# EAGLE design v3pow (EAGLE 8.0.1)
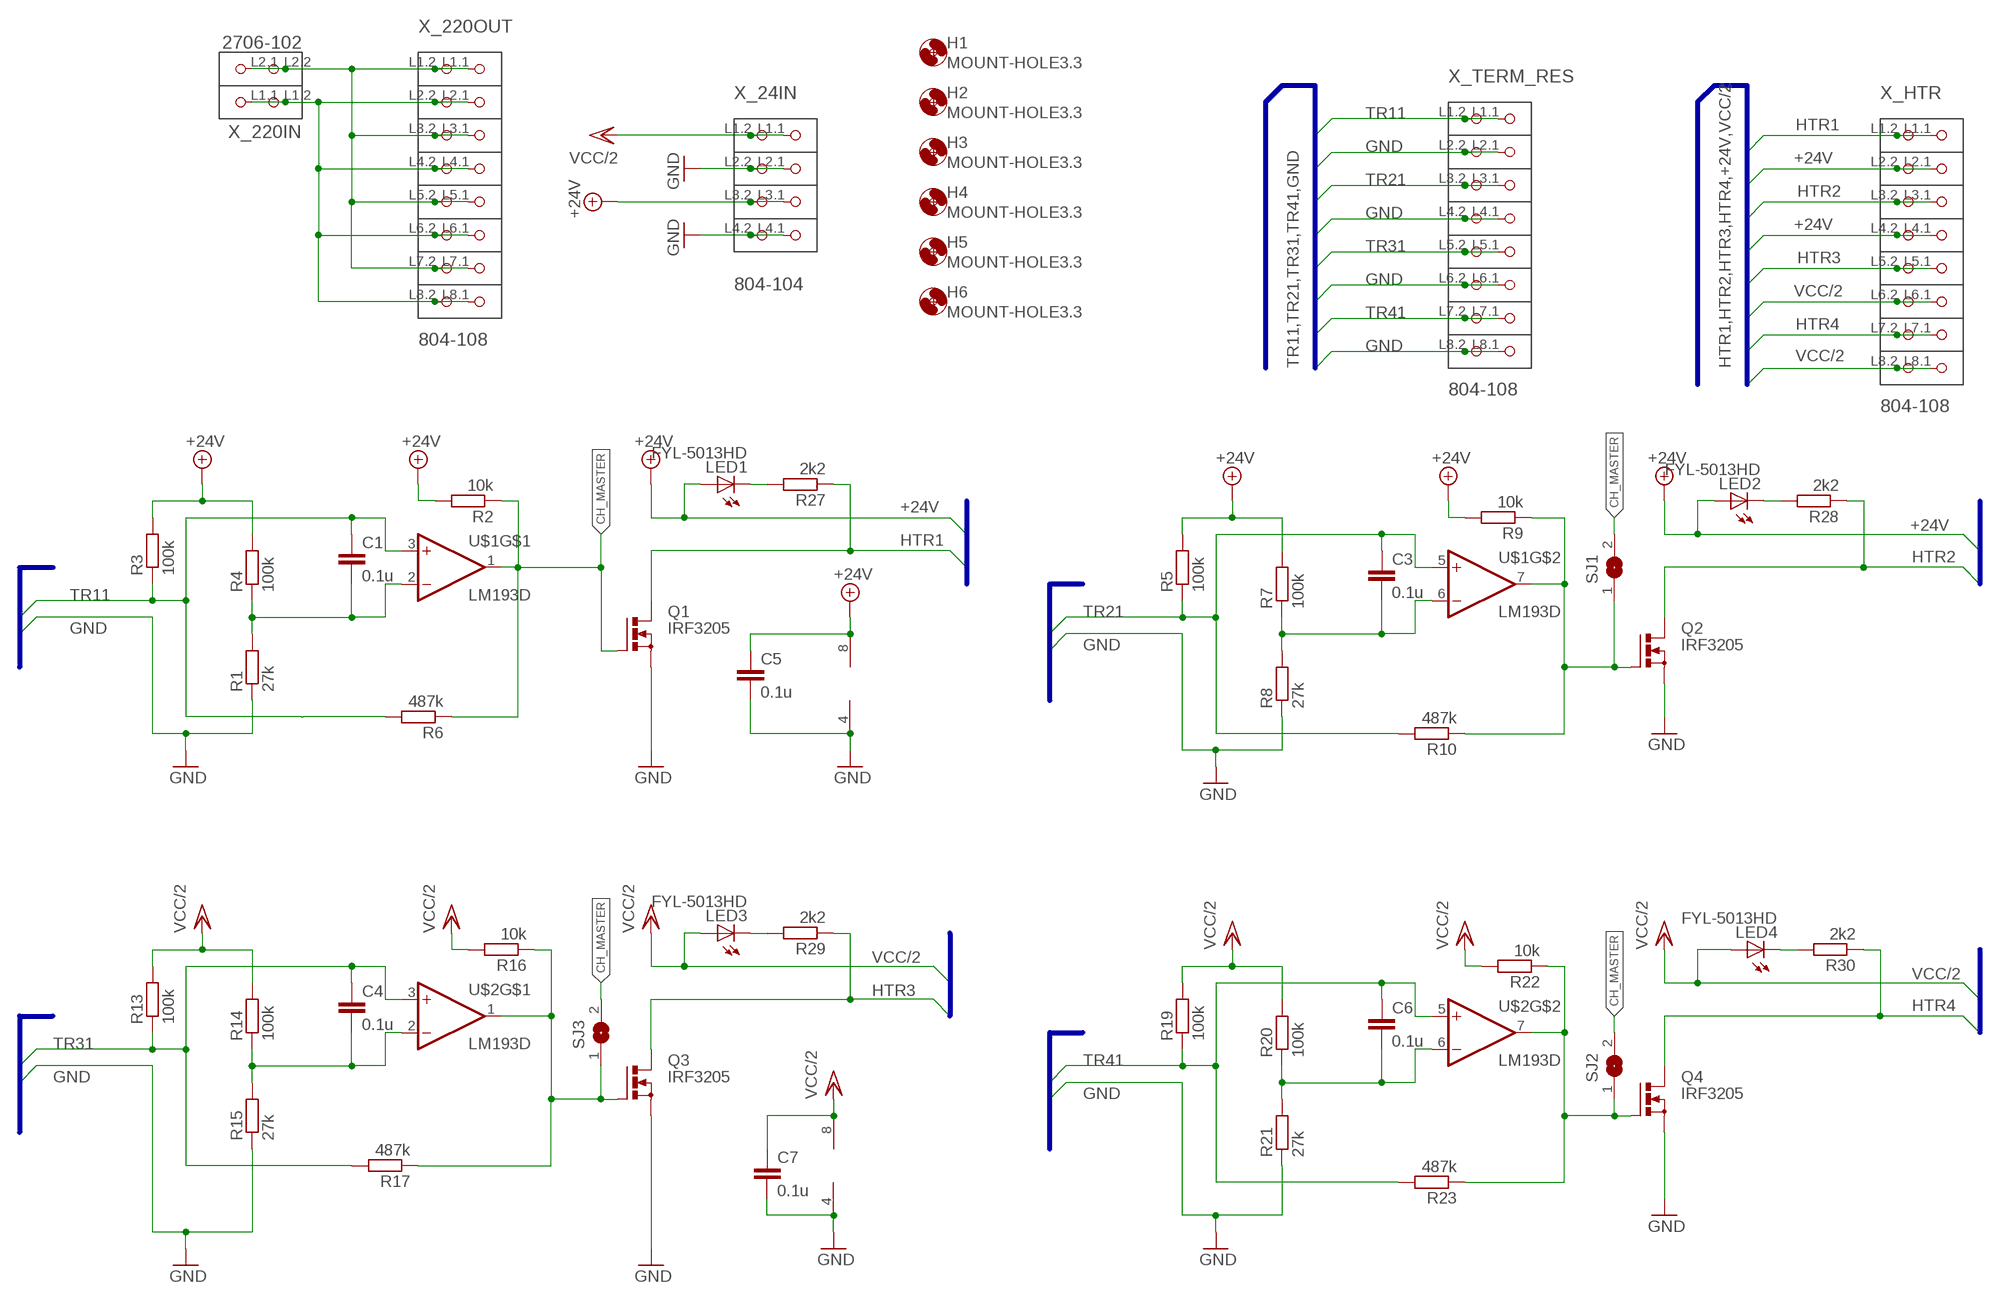
[diagram p0: schematic, sheet 1]

## Parts
C1  0.1u  C-EUC0805  [C0805]
C3  0.1u  C-EUC0805  [C0805]
C4  0.1u  C-EUC0805  [C0805]
C5  0.1u  C-EUC0805  [C0805]
C6  0.1u  C-EUC0805  [C0805]
C7  0.1u  C-EUC0805  [C0805]
H1  MOUNT-HOLE3.3  [3,3]
H2  MOUNT-HOLE3.3  [3,3]
H3  MOUNT-HOLE3.3  [3,3]
H4  MOUNT-HOLE3.3  [3,3]
H5  MOUNT-HOLE3.3  [3,3]
H6  MOUNT-HOLE3.3  [3,3]
LED1  FYL-5013HD  LED5MM  [LED5MM]
LED2  FYL-5013HD  LED5MM  [LED5MM]
LED3  FYL-5013HD  LED5MM  [LED5MM]
LED4  FYL-5013HD  LED5MM  [LED5MM]
Q1  IRF3205  PMOSFET_NTO220BV  [TO220BV]
Q2  IRF3205  PMOSFET_NTO220BV  [TO220BV]
Q3  IRF3205  PMOSFET_NTO220BV  [TO220BV]
Q4  IRF3205  PMOSFET_NTO220BV  [TO220BV]
R1  27k  R-EU_M0805  [M0805]
R2  10k  R-EU_M0805  [M0805]
R3  100k  R-EU_M0805  [M0805]
R4  100k  R-EU_M0805  [M0805]
R5  100k  R-EU_M0805  [M0805]
R6  487k  R-EU_M0805  [M0805]
R7  100k  R-EU_M0805  [M0805]
R8  27k  R-EU_M0805  [M0805]
R9  10k  R-EU_M0805  [M0805]
R10  487k  R-EU_M0805  [M0805]
R13  100k  R-EU_M0805  [M0805]
R14  100k  R-EU_M0805  [M0805]
R15  27k  R-EU_M0805  [M0805]
R16  10k  R-EU_M0805  [M0805]
R17  487k  R-EU_M0805  [M0805]
R19  100k  R-EU_M0805  [M0805]
R20  100k  R-EU_M0805  [M0805]
R21  27k  R-EU_M0805  [M0805]
R22  10k  R-EU_M0805  [M0805]
R23  487k  R-EU_M0805  [M0805]
R27  2k2  R-EU_M0805  [M0805]
R28  2k2  R-EU_M0805  [M0805]
R29  2k2  R-EU_M0805  [M0805]
R30  2k2  R-EU_M0805  [M0805]
SJ1  SJ  [SJ]
SJ2  SJ  [SJ]
SJ3  SJ  [SJ]
U$1  LM193D  [SO08]
U$2  LM193D  [SO08]
X_24IN  804-104  [P-804-104]
X_220IN  2706-102  [P-2706-102]
X_220OUT  804-108  [P-804-108]
X_HTR  804-108  [P-804-108]
X_TERM_RES  804-108  [P-804-108]

## Nets
+24V [24pow]: C5.1 LED1.A LED2.A R2.2 R3.2 R4.2 R5.2 R7.2 R9.2 U$1.8(V+) X_24IN.L3.1(P3.1) X_24IN.L3.2(P3.2) X_HTR.L2.1(P2.1) X_HTR.L2.2(P2.2) X_HTR.L4.1(P4.1) X_HTR.L4.2(P4.2)
CH_MASTER: Q1.G R2.1 R6.1 SJ1.2 SJ2.2 SJ3.2 U$1.1(OUT)
GND [24pow]: C5.2 C7.2 Q1.S Q2.S Q3.S Q4.S R1.1 R8.1 R15.1 R21.1 U$1.4(V-) U$2.4(V-) X_24IN.L2.1(P2.1) X_24IN.L2.2(P2.2) X_24IN.L4.1(P4.1) X_24IN.L4.2(P4.2) X_TERM_RES.L2.1(P2.1) X_TERM_RES.L2.2(P2.2) X_TERM_RES.L4.1(P4.1) X_TERM_RES.L4.2(P4.2) X_TERM_RES.L6.1(P6.1) X_TERM_RES.L6.2(P6.2) X_TERM_RES.L8.1(P8.1) X_TERM_RES.L8.2(P8.2)
HTR1: Q1.D R27.1 X_HTR.L1.1(P1.1) X_HTR.L1.2(P1.2)
HTR2: Q2.D R28.1 X_HTR.L3.1(P3.1) X_HTR.L3.2(P3.2)
HTR3: Q3.D R29.1 X_HTR.L5.1(P5.1) X_HTR.L5.2(P5.2)
HTR4: Q4.D R30.1 X_HTR.L7.1(P7.1) X_HTR.L7.2(P7.2)
N44 [f220]: X_220IN.L2.1(P2.1) X_220IN.L2.2(P2.2) X_220OUT.L1.1(P1.1) X_220OUT.L1.2(P1.2) X_220OUT.L3.1(P3.1) X_220OUT.L3.2(P3.2) X_220OUT.L5.1(P5.1) X_220OUT.L5.2(P5.2) X_220OUT.L7.1(P7.1) X_220OUT.L7.2(P7.2)
N$1: Q3.G R16.1 R17.1 SJ3.1 U$2.1(OUT)
N$2: Q2.G R9.1 R10.1 SJ1.1 U$1.7(OUT)
N$3: Q4.G R22.1 R23.1 SJ2.1 U$2.7(OUT)
N$10: C3.2 R7.1 R8.2 U$1.6(-IN)
N$13: C1.2 R1.2 R4.1 U$1.2(-IN)
N$15: C4.2 R14.1 R15.2 U$2.2(-IN)
N$20: C6.2 R20.1 R21.2 U$2.6(-IN)
N$28: LED1.K(C) R27.2
N$31: LED2.K(C) R28.2
N$34: LED3.K(C) R29.2
N$36: LED4.K(C) R30.2
NN55 [f220]: X_220IN.L1.1(P1.1) X_220IN.L1.2(P1.2) X_220OUT.L2.1(P2.1) X_220OUT.L2.2(P2.2) X_220OUT.L4.1(P4.1) X_220OUT.L4.2(P4.2) X_220OUT.L6.1(P6.1) X_220OUT.L6.2(P6.2) X_220OUT.L8.1(P8.1) X_220OUT.L8.2(P8.2)
TR11: C1.1 R3.1 R6.2 U$1.3(+IN) X_TERM_RES.L1.1(P1.1) X_TERM_RES.L1.2(P1.2)
TR21: C3.1 R5.1 R10.2 U$1.5(+IN) X_TERM_RES.L3.1(P3.1) X_TERM_RES.L3.2(P3.2)
TR31: C4.1 R13.1 R17.2 U$2.3(+IN) X_TERM_RES.L5.1(P5.1) X_TERM_RES.L5.2(P5.2)
TR41: C6.1 R19.1 R23.2 U$2.5(+IN) X_TERM_RES.L7.1(P7.1) X_TERM_RES.L7.2(P7.2)
VCC/2: C7.1 LED3.A LED4.A R13.2 R14.2 R16.2 R19.2 R20.2 R22.2 U$2.8(V+) X_24IN.L1.1(P1.1) X_24IN.L1.2(P1.2) X_HTR.L6.1(P6.1) X_HTR.L6.2(P6.2) X_HTR.L8.1(P8.1) X_HTR.L8.2(P8.2)

## Buses
TR11,TR12,TR21,TR22,TR31,TR32,TR41,TR42,GND
HTR1,HTR2,HTR3,HTR4,+24V,VCC/2
TR11,TR21,TR31,TR41,GND

## Library data of the parts
C1 C3-C7 = rcl:C-EU: CAPACITOR, European symbol
H1-H6 = holes:MOUNT-HOLE: MOUNTING HOLE with drill center marker
LED1-LED4 = adafruit:LED: LED OSRAM: - CHIPLED LG R971, LG N971, LY N971, LG Q971, LY Q971, LO R971, LY R971 LH N974, LH R974 LS Q976, LO Q976, LY Q976 LO Q996 - Hyper CHIPLED LW Q18S LB Q993, LB Q99A, LB R99A - SideLED LS A670, LO A670, LY A670, LG A670, LP A670 LB A673, LV A673, LT A673, LW A673 LH A674 LY A675 LS A676, LA A676, LO A676, LY A676, LW A676 LS A679, LY A679, LG A679 - Hyper Micro SIDELED® LS Y876, LA Y876, LO Y876, LY Y876 LT Y87S - SmartLED LW L88C, LW L88S LB L89C, LB L89S, LG L890 LS L89K, LO L89K, LY L89K LS L896, LA L896, LO L896, LY L896 - TOPLED LS T670, LO T670, LY T670, LG T670, LP T670 LSG T670, LSP T670, LSY T670, LOP T670, LYG T670 LG T671, LOG T671, LSG T671 LB T673, LV T673, LT T673, LW T673 LH T674 LS T676, LA T676, LO T676, LY T676, LB T676, LH T676, LSB T676, LW T676 LB T67C, LV T67C, LT T67C, LS T67K, LO T67K, LY T67K, LW E67C LS E67B, LA E67B, LO E67B, LY E67B, LB E67C, LV E67C, LT E67C LW T67C LS T679, LY T679, LG T679 LS T770, LO T770, LY T770, LG T770, LP T770 LB T773, LV T773, LT T773, LW T773 LH T774 LS E675, LA E675, LY E675, LS T675 LS T776, LA T776, LO T776, LY T776, LB T776 LHGB T686 LT T68C, LB T68C - Hyper Mini TOPLED® LB M676 - Mini TOPLED Santana® LG M470 LS M47K, LO M47K, LY M47K Source: http://www.osram.convergy.de/
Q1-Q4 = transistor-power:PMOSFET_N: Power MOSFET N-Channel
R1-R10 R13-R17 R19-R23 R27-R30 = rcl:R-EU_: RESISTOR, European symbol
SJ1-SJ3 = jumper:SJ: SMD solder JUMPER
U$1 U$2 = linear:LM193: lm193 LM193
X_24IN = con-wago_804:804-104: Serie 804, 1-Leiter-Klemmenleiste für Leiterplatten 2 Lötstifte/Pol versetzt / Series 804, 1-conductor PCB terminal strip 2 solder pins/pole, staggered Polzahl / Pole No.: 4 Rastermaß / Pitch: 5 - 5 mm Bemessungsspannung / Rated Voltage: 320 V Nennstrom / Nominal Current: 24 A Leiterquerschnitt / Conductor Size: 0.25 - 2.5 mm2 Anschlusstechnik / Connection Technology: CAGE CLAMP® S Lötstiftlänge: / Solder Pin Length: 3.6 mm Leitereinführung (zur Platine) / Conductor entry angle (to PCB): 0 ° Farbe / Color: grau / gray Stand: 01.01.2014. Die jeweils aktuellen Daten zu diesem Artikel finden Sie in unserem Produktkatalog, den Sie unter www.wago.com einsehen können. As of: 01/01/2014. Please find the newest data for this article in our product catalogue, which can be viewed under www.wago.com.
X_220IN = con-wago_2706:2706-102: Serie 2706, Klemmenleisten mit Betätigungshebeln 2 Lötstifte/Pol / Series 2706, Terminal strips with operating levers 2 solder pins/pole Polzahl / Pole No.: 2 Rastermaß / Pitch: 7.5 mm Bemessungsspannung / Rated Voltage: 630 V Nennstrom / Nominal Current: 41 A Leiterquerschnitt / Conductor Size: 0.5 - 6 mm2 Anschlusstechnik / Connection Technology: CAGE CLAMP® Lötstiftlänge: / Solder Pin Length: 4.5 mm Leitereinführung (zur Platine) / Conductor entry angle (to PCB): 30 ° Farbe / Color: grau / gray Stand: 01.01.2014. Die jeweils aktuellen Daten zu diesem Artikel finden Sie in unserem Produktkatalog, den Sie unter www.wago.com einsehen können. As of: 01/01/2014. Please find the newest data for this article in our product catalogue, which can be viewed under www.wago.com.
X_220OUT X_HTR X_TERM_RES = con-wago_804:804-108: Serie 804, 1-Leiter-Klemmenleiste für Leiterplatten 2 Lötstifte/Pol versetzt / Series 804, 1-conductor PCB terminal strip 2 solder pins/pole, staggered Polzahl / Pole No.: 8 Rastermaß / Pitch: 5 - 5 mm Bemessungsspannung / Rated Voltage: 320 V Nennstrom / Nominal Current: 24 A Leiterquerschnitt / Conductor Size: 0.25 - 2.5 mm2 Anschlusstechnik / Connection Technology: CAGE CLAMP® S Lötstiftlänge: / Solder Pin Length: 3.6 mm Leitereinführung (zur Platine) / Conductor entry angle (to PCB): 0 ° Farbe / Color: grau / gray Stand: 01.01.2014. Die jeweils aktuellen Daten zu diesem Artikel finden Sie in unserem Produktkatalog, den Sie unter www.wago.com einsehen können. As of: 01/01/2014. Please find the newest data for this article in our product catalogue, which can be viewed under www.wago.com.

## Net classes
0 default: width 0.508 mm
1 f220: width 1.524 mm, clearance 1.27 mm
2 24pow: width 1.016 mm

## Board
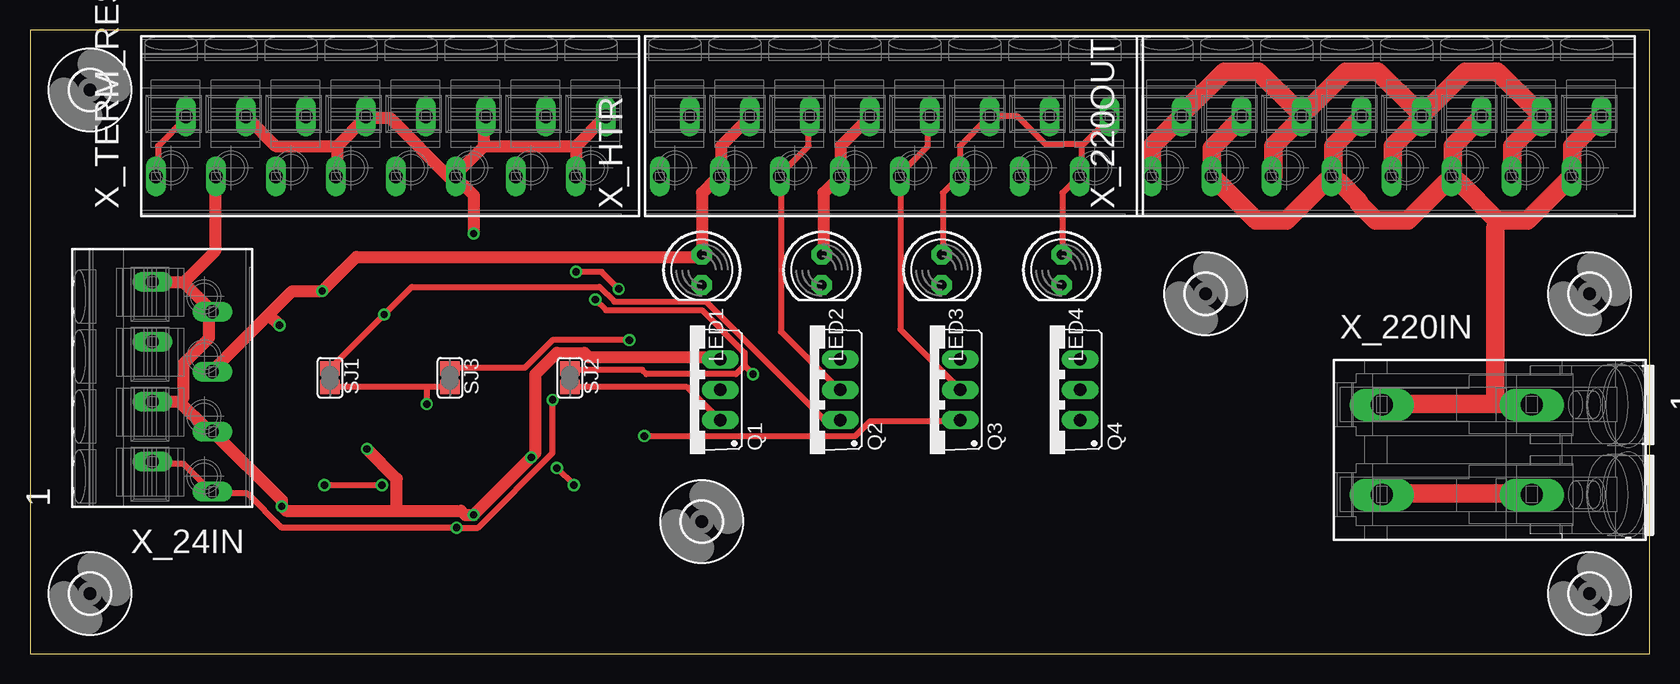
[diagram p1: board, top side]
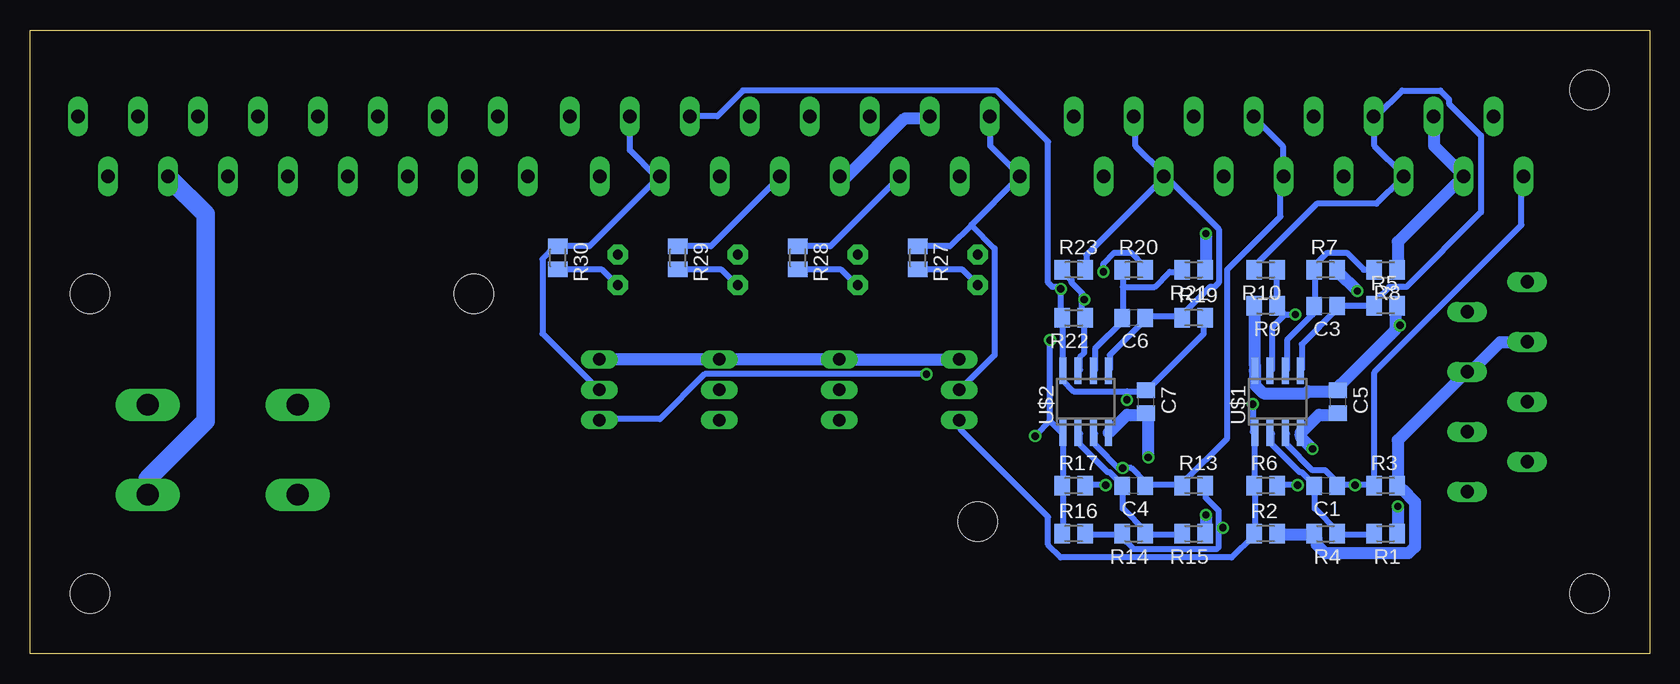
[diagram p2: board, bottom side, seen from below]

Size 135 x 52 mm. Coordinates in mm from the lower left corner, seen from the top.
Outline: 0,0 135,0 135,52 0,52 0,0
Copper layers (1*16): Top 0.035mm / dielectric 1.5mm / Bottom 0.035mm
Design rules "default": minimum track width 10mil, minimum drill 24mil, track to track 8mil, track to pad 8mil, pad to pad 8mil, via to via 8mil, smd to smd 8mil, copper to edge 40mil, drill to drill 8mil, minimum pad ring 10mil, minimum via ring 8mil, stop-mask expansion 4mil, vias tented up to drill 0mil, thermal gap 10mil

### Footprints (pad centres in the part's own frame; a part is rotated, then mirrored left to right if it is on the bottom)
C0805 = smd 1.3 x 1.5: 1 -0.95,0; 2 0.95,0
3,3 = hole 3.3: 0,0
LED5MM = drill 0.813 pad 1.676 octagon: A -1.27,0; K 1.27,0
TO220BV = drill 1.016 long: D 0,-2.54; G -2.54,-2.54; S 2.54,-2.54
M0805 = smd 1.3 x 1.6: 1 -0.95,0; 2 0.95,0
SJ = smd 1.168 x 1.6: 1 -0.762,0; 2 0.762,0
SO08 = smd 0.6 x 2.2: 1 -1.905,-2.6; 2 -0.635,-2.6; 3 0.635,-2.6; 4 1.905,-2.6; 5 1.905,2.6; 6 0.635,2.6; 7 -0.635,2.6; 8 -1.905,2.6
P-804-104 = drill 1.1 long: L1.1 0.8,7; L1.2 -4.2,9.5; L2.1 0.8,2; L2.2 -4.2,4.5; L3.1 0.8,-3; L3.2 -4.2,-0.5; L4.1 0.8,-8; L4.2 -4.2,-5.5
P-2706-102 = drill 1.8 long: L1.1 3.185,3.75; L1.2 -9.315,3.75; L2.1 3.185,-3.75; L2.2 -9.315,-3.75
P-804-108 = drill 1.1 long: L1.1 0.8,17; L1.2 -4.2,19.5; L2.1 0.8,12; L2.2 -4.2,14.5; L3.1 0.8,7; L3.2 -4.2,9.5; L4.1 0.8,2; L4.2 -4.2,4.5; L5.1 0.8,-3; L5.2 -4.2,-0.5; L6.1 0.8,-8; L6.2 -4.2,-5.5; L7.1 0.8,-13; L7.2 -4.2,-10.5; L8.1 0.8,-18; L8.2 -4.2,-15.5

### Placement (x,y rotation side)
C1  27,14 180 bottom
C3  27,29 180 bottom
C4  43,14 180 bottom
C5  26,21 270 bottom
C6  43,28 180 bottom
C7  42,21 270 bottom
H1  5,47 0 top
H2  5,5 0 top
H3  130,5 0 top
H4  56,11 0 top
H5  130,30 0 top
H6  98,30 0 top
LED1  56,32 270 top
LED2  66,32 270 top
LED3  76,32 270 top
LED4  86,32 270 top
Q1  55,22 90 top
Q2  65,22 90 top
Q3  75,22 90 top
Q4  85,22 90 top
R1  22,10 180 bottom
R2  32,10 0 bottom
R3  22,14 0 bottom
R4  27,10 180 bottom
R5  22,29 0 bottom
R6  32,14 0 bottom
R7  27,32 0 bottom
R8  22,32 180 bottom
R9  32,29 180 bottom
R10  32,32 180 bottom
R13  38,14 0 bottom
R14  43,10 180 bottom
R15  38,10 180 bottom
R16  48,10 0 bottom
R17  48,14 0 bottom
R19  38,28 0 bottom
R20  43,32 0 bottom
R21  38,32 180 bottom
R22  48,28 180 bottom
R23  48,32 0 bottom
R27  61,33 270 bottom
R28  71,33 270 bottom
R29  81,33 270 bottom
R30  91,33 270 bottom
SJ1  25,23 270 top
SJ2  45,23 270 top
SJ3  35,23 270 top
U$1  31,21 0 bottom
U$2  47,21 0 bottom
X_24IN  11,23 180 top
X_220IN  122,17 0 top
X_220OUT  113,44 90 top
X_HTR  72,44 90 top
X_TERM_RES  30,44 90 top

### Tracks (layer width: path | path; a pad name or v marks a point on that pad's centre or on a via)
+24V  (via drill 0.61)
  Top 1.016: X_HTR.L2.1 59.92,44.63 57.61,42.32 57.61,39.83 X_HTR.L2.2 57.07,39.47 56.01,38.41 56.01,33.43 LED1.A 55.65,33.07 27.2,33.07 v24.36,30.23 21.87,30.23 19.91,28.27 | X_HTR.L4.1 69.88,44.63 67.56,42.32 67.56,39.83 X_HTR.L4.2 67.21,39.47 66.14,38.41 66.14,33.43 LED2.A | 19.91,28.27 15.29,23.65 X_24IN.L3.2 | 19.91,28.27 v20.8,27.38
  Bottom 1.016: X_HTR.L2.1 60.1,44.63 62.05,44.63 66.85,39.83 67.39,39.83 X_HTR.L4.2 | 21.16,27.38 21.16,27.03 25.78,22.4 C5.1 26.14,21.87 28.45,21.87 28.63,21.69 32.18,21.69 32.89,22.4 32.89,23.47 U$1.8 32.89,24 32.89,28.98 R9.2 | 21.16,27.38 21.16,28.98 R5.2 | R2.2 30.94,9.96 28.09,9.96 R4.2 27.74,9.6 27.74,9.07 27.03,8.36 20.09,8.36 19.56,8.89 19.56,12.62 20.62,13.69 R3.2 20.98,14.05 20.98,17.78 15.29,23.47 X_24IN.L3.2 14.76,23.65 12.45,25.96 10.31,25.96 X_24IN.L3.1 | v24.36,30.23 25.96,31.83 R7.2 | v20.8,27.38 21.16,27.38
CH_MASTER  (via drill 0.61)
  Top 0.508: SJ2.2 45.16,22.23 54.76,22.23 57.43,19.56 Q1.G | 33.07,22.23 34.85,22.23 SJ3.2 | 33.07,22.23 25.07,22.23 SJ1.2 | 33.07,22.23 v33.07,20.8
  Bottom 0.508: v33.07,20.8 33.07,18.49 U$1.1 32.89,18.31 32.89,14.22 R6.1 32.89,13.87 32.89,10.13 R2.1 33.07,9.78 34.85,8 49.07,8 50.14,9.07 50.14,11.38 57.43,18.67 57.43,19.38 Q1.G
GND  (via drill 0.61)
  Top 1.016: 25.6,42.32 25.6,39.83 X_TERM_RES.L4.2 | 25.6,42.32 27.91,44.63 X_TERM_RES.L4.1 28.45,44.63 30.05,44.63 35.03,39.65 X_TERM_RES.L6.2 | 25.6,42.32 20.45,42.32 18.14,44.63 X_TERM_RES.L2.1 | 45.52,42.32 45.52,39.83 X_TERM_RES.L8.2 | 45.52,42.32 47.83,44.63 X_TERM_RES.L8.1 | v36.98,35.03 36.98,38.23 35.56,39.65 X_TERM_RES.L6.2 | 37.87,42.32 37.87,44.63 X_TERM_RES.L6.1 | 37.87,42.32 35.74,40.18 X_TERM_RES.L6.2 | 37.87,42.32 45.52,42.32 | 12.8,30.94 10.31,30.94 X_24IN.L4.1 | 12.8,30.94 15.11,28.63 X_24IN.L4.2 14.94,28.09 14.94,26.31 12.8,24.18 12.8,21.34 12.45,20.98 | 30.58,11.91 21.34,11.91 v20.98,12.27 20.98,12.8 15.29,18.49 X_24IN.L2.2 14.76,18.67 12.45,20.98 | 30.58,11.91 35.92,11.91 36.27,11.56 v36.98,11.56 v41.78,16.36 42.14,16.71 42.14,23.29 43.92,25.07 46.23,25.07 46.58,24.71 57.43,24.71 Q1.S | 12.45,20.98 10.31,20.98 X_24IN.L2.1 | v28.09,17.07 30.58,14.58 30.58,11.91 | 12.8,30.94 15.47,33.6 15.47,39.65 X_TERM_RES.L2.2
  Bottom 1.016: R8.1 20.98,32 20.98,34.31 15.65,39.65 X_TERM_RES.L2.2 15.82,40.18 17.96,42.32 17.96,44.63 X_TERM_RES.L2.1 | v36.98,35.03 36.98,32 R21.1 | Q1.S 57.61,24.54 67.39,24.54 Q2.S 67.92,24.54 77.52,24.54 Q3.S 78.05,24.54 87.48,24.54 Q4.S | U$2.4 44.98,18.49 43.56,19.91 42.14,19.91 C7.2 41.78,19.56 v41.78,16.36 | C5.2 26.14,19.91 27.56,19.91 28.98,18.49 U$1.4 28.98,17.96 v28.09,17.07 | v20.98,12.27 20.98,10.13 R1.1 | v36.98,11.56 36.98,10.13 R15.1
HTR1
  Bottom 0.508: 56.54,35.74 52.63,39.65 X_HTR.L1.2 52.63,40.01 54.94,42.32 54.94,44.63 X_HTR.L1.1 | 56.54,35.74 58.32,33.96 60.98,33.96 R27.1 | 56.54,35.74 54.59,33.78 54.59,24.89 57.43,22.05 Q1.D
HTR2
  Top 0.508: Q2.D 67.39,22.05 62.59,26.85 62.59,39.65 X_HTR.L3.2 62.59,40.01 64.9,42.32 64.9,44.63 X_HTR.L3.1
  Bottom 0.508: R28.1 70.94,33.96 68.28,33.96 62.59,39.65 X_HTR.L3.2
HTR3
  Top 0.508: Q3.D 77.52,22.05 72.54,27.03 72.54,39.65 X_HTR.L5.2 72.54,40.01 74.85,42.32 74.85,44.63 X_HTR.L5.1
  Bottom 0.508: R29.1 80.9,33.96 78.23,33.96 72.54,39.65 X_HTR.L5.2
HTR4
  Bottom 0.508: Q4.D 87.66,22.05 92.28,26.67 92.28,32.89 91.21,33.96 R30.1 90.86,33.96 88.37,33.96 82.68,39.65 X_HTR.L7.2 82.86,39.83 84.99,41.96 84.99,44.63 X_HTR.L7.1
N44
  Top 1.524: X_220OUT.L1.2 93.52,39.83 93.52,42.32 95.83,44.63 X_220OUT.L1.1 96.37,45.34 99.57,48.54 102.41,48.54 105.61,45.34 X_220OUT.L3.1 | X_220OUT.L3.2 103.66,39.83 103.66,42.32 105.97,44.63 X_220OUT.L3.1 | X_220IN.L2.2 112.72,13.34 125.17,13.34 X_220IN.L2.1 | X_220OUT.L5.2 113.61,39.83 113.61,42.32 115.93,44.63 X_220OUT.L5.1 | X_220OUT.L7.2 123.57,39.83 123.57,42.32 125.88,44.63 X_220OUT.L7.1 125.53,45.34 122.33,48.54 119.66,48.54 116.46,45.34 X_220OUT.L5.1 | X_220OUT.L3.1 106.5,45.34 109.7,48.54 112.37,48.54 115.57,45.34 X_220OUT.L5.1
  Bottom 1.524: X_220IN.L2.1 125.17,13.34 125.17,14.58 120.37,19.38 120.37,36.63 123.39,39.65 X_220OUT.L7.2
N$1  (via drill 0.61)
  Top 0.508: v49.96,26.14 43.56,26.14 41.25,23.82 35.03,23.82 SJ3.1 | v51.21,18.14 68.81,18.14 70.05,19.38 77.52,19.38 Q3.G
  Bottom 0.508: R16.1 48.9,10.13 48.9,13.87 R17.1 48.9,14.22 48.9,18.31 U$2.1 49.07,18.49 49.96,19.38 | 49.96,19.38 v49.96,26.14 | 49.96,19.38 v51.21,18.14
N$2  (via drill 0.61)
  Top 0.508: SJ1.1 25.07,23.82 v29.52,28.27 31.83,30.58 47.47,30.58 48.72,29.34 56.36,29.34 66.14,19.56 67.39,19.56 Q2.G
  Bottom 0.508: R10.1 31.11,31.83 31.11,29.16 R9.1 30.94,28.8 30.4,28.27 | 30.4,28.27 v29.52,28.27 | 30.4,28.27 31.47,27.2 31.47,23.65 U$1.7
N$3  (via drill 0.61)
  Top 0.508: 59.56,24 58.85,23.29 51.38,23.29 51.03,23.65 45.16,23.65 SJ2.1 | 59.56,24 59.56,25.07 56.01,28.63 48.01,28.63 v47.12,29.52 | 59.56,24 v60.27,23.29
  Bottom 0.508: U$2.7 47.47,23.65 47.47,24.71 47.12,25.07 47.12,27.91 R22.1 47.3,28.09 47.3,29.52 | 47.3,29.52 47.3,30.05 48.18,30.94 48.18,31.11 48.9,31.83 R23.1 | v47.12,29.52 47.3,29.52 | v60.27,23.29 78.77,23.29 82.5,19.56 87.48,19.56 Q4.G
N$10
  Bottom 0.508: R8.2 23.11,32 23.82,32 25.25,33.43 26.85,33.43 28.09,32.18 R7.1 27.91,31.83 27.91,29.16 C3.2 28.09,28.8 28.09,28.27 30.23,26.14 30.23,23.65 U$1.6
N$13
  Bottom 0.508: R1.2 23.11,9.96 25.78,9.96 R4.1 25.96,10.13 27.91,12.09 27.91,13.87 C1.2 28.09,14.22 28.98,15.11 29.16,15.11 31.47,17.42 31.47,18.31 U$1.2
N$15
  Bottom 0.508: R15.2 39.12,9.96 41.78,9.96 R14.1 41.96,10.13 43.92,12.09 43.92,13.87 C4.2 44.09,14.22 44.98,15.11 45.16,15.11 47.47,17.42 47.47,18.31 U$2.2
N$20
  Bottom 0.508: 43.92,30.58 43.92,31.83 R20.1 | 43.92,30.58 43.92,28.09 C6.2 43.92,27.74 46.23,25.43 46.23,23.65 U$2.6 | 43.92,30.58 41.25,30.58 40.01,31.83 39.12,31.83 R21.2
N$28
  Bottom 0.508: R27.2 60.98,32 57.25,32 56.01,30.76 LED1.K
N$31
  Bottom 0.508: R28.2 70.94,32 67.39,32 66.14,30.76 LED2.K
N$34
  Bottom 0.508: R29.2 80.9,32 77.34,32 76.1,30.76 LED3.K
N$36
  Bottom 0.508: R30.2 90.86,32 87.3,32 86.06,30.76 LED4.K
NN55
  Top 1.524: X_220OUT.L2.1 100.99,44.63 98.5,42.14 98.5,39.83 X_220OUT.L2.2 99.03,39.29 102.23,36.09 104.72,36.09 107.92,39.29 X_220OUT.L4.2 | X_220OUT.L4.2 108.64,39.83 108.64,42.32 110.95,44.63 X_220OUT.L4.1 | 122.15,20.8 125.17,20.8 X_220IN.L1.1 | 122.15,20.8 112.72,20.8 X_220IN.L1.2 | X_220OUT.L6.2 118.59,39.83 118.59,42.32 120.9,44.63 X_220OUT.L6.1 | X_220OUT.L8.1 130.86,44.63 128.55,42.32 128.55,39.83 X_220OUT.L8.2 128.02,39.29 124.82,36.09 122.33,36.09 | 122.33,36.09 119.13,39.29 X_220OUT.L6.2 | 122.15,20.8 122.15,35.38 122.33,36.09 | X_220OUT.L4.2 109.17,39.29 110.77,37.69 110.77,37.52 112.19,36.09 114.86,36.09 118.06,39.29 X_220OUT.L6.2
TR11  (via drill 0.61)
  Top 0.508: X_TERM_RES.L1.2 10.67,39.83 10.67,42.32 12.98,44.63 X_TERM_RES.L1.1 | v24.54,14.05 v29.34,14.05
  Bottom 0.508: v29.34,14.05 30.94,14.05 R6.2 | U$1.3 30.23,18.31 30.23,17.42 28.09,15.29 27.03,15.29 25.96,14.22 C1.1 25.96,14.05 v24.54,14.05 23.11,14.05 R3.1 22.94,14.22 22.94,23.47 10.67,35.74 10.67,39.65 X_TERM_RES.L1.2
TR21
  Bottom 0.508: U$1.5 28.98,23.65 28.98,25.78 25.96,28.8 C3.1 25.96,28.98 23.11,28.98 R5.1 22.76,29.16 22.76,29.52 21.69,30.58 20.27,30.58 14.05,36.8 14.05,43.2 16.71,45.87 16.71,46.23 17.42,46.94 20.62,46.94 22.76,44.81 X_TERM_RES.L3.1 22.94,44.63 22.94,42.32 20.62,40.01 X_TERM_RES.L3.2 20.62,39.65 22.76,37.52 27.74,37.52 32.89,32.36 32.89,32 R10.2
TR31  (via drill 0.61)
  Top 0.508: v43.92,15.47 v45.34,14.05
  Bottom 0.508: X_TERM_RES.L5.1 32.89,44.63 30.58,42.32 30.58,39.83 X_TERM_RES.L5.2 30.76,39.65 30.76,36.45 35.2,32 35.2,17.96 38.94,14.22 R13.1 39.12,14.05 41.96,14.05 C4.1 41.96,14.22 43.2,15.47 v43.92,15.47 44.09,15.29 46.23,17.42 46.23,18.31 U$2.3 | v45.34,14.05 46.94,14.05 R17.2
TR41
  Bottom 0.508: U$2.5 44.98,23.65 44.98,24.89 41.96,27.91 C6.1 41.96,28.09 39.12,28.09 R19.1 38.94,28.27 36.63,30.58 36.27,30.58 35.92,30.94 35.92,35.38 40.36,39.83 X_TERM_RES.L7.2 | R23.2 46.94,32 46.94,33.25 40.54,39.65 X_TERM_RES.L7.2 | X_TERM_RES.L7.1 42.85,44.63 42.85,42.32 40.54,40.01 X_TERM_RES.L7.2
VCC/2  (via drill 0.61)
  Top 0.508: LED3.A 76.1,33.43 76.1,38.41 77.34,39.65 X_HTR.L6.2 77.52,39.83 77.52,42.32 79.83,44.63 X_HTR.L6.1 80.19,44.81 82.32,44.81 84.63,42.49 87.48,42.49 87.66,42.32 | 87.66,42.32 87.66,39.83 X_HTR.L8.2 87.3,39.65 86.06,38.41 86.06,33.43 LED4.A | 87.66,42.32 89.97,44.63 X_HTR.L8.1 | v45.52,31.83 47.65,31.83 v49.07,30.4 | X_24IN.L1.1 10.31,15.82 12.8,15.82 15.11,13.51 X_24IN.L1.2 15.29,13.34 18.14,13.34 20.98,10.49 v35.56,10.49 37.34,10.49 43.56,16.71 v43.56,21.16
  Bottom 0.508: 43.56,21.87 48.01,21.87 48.9,22.76 48.9,23.47 U$2.8 48.9,23.82 48.9,27.91 R22.2 49.07,28.09 v49.07,30.4 49.25,30.58 49.78,30.58 50.14,30.94 50.14,42.67 54.41,46.94 75.56,46.94 77.7,44.81 79.83,44.81 X_HTR.L6.1 | 43.56,21.87 42.14,21.87 C7.1 41.78,22.05 37.16,26.67 37.16,27.91 R19.2 | v45.52,31.83 45.52,32.54 44.63,33.43 43.2,33.43 42.14,32.36 42.14,32 R20.2 | R16.2 46.94,9.96 44.09,9.96 R14.2 44.09,9.78 43.03,8.71 36.09,8.71 35.92,8.89 35.92,10.49 | 35.92,10.49 35.92,11.91 36.98,12.98 36.98,13.87 R13.2 | v35.56,10.49 35.92,10.49 | v43.56,21.16 43.56,21.87